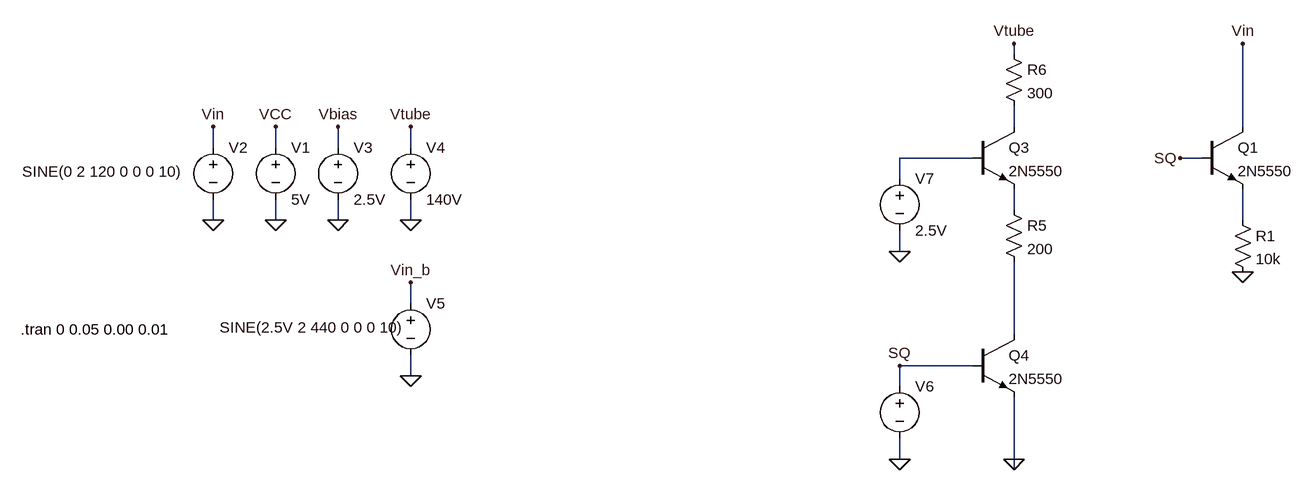
[diagram p0: schematic TubeDriver.asc]
TubeDriver.asc, the LTspice schematic file:
Version 4
SHEET 1 1540 860
WIRE 1072 -16 1072 -32
WIRE 1072 96 1072 64
WIRE 1424 96 1424 -32
WIRE -160 128 -160 96
WIRE -64 128 -64 96
WIRE 32 128 32 96
WIRE 144 128 144 96
WIRE 1008 144 896 144
WIRE 1360 144 1328 144
WIRE 896 176 896 144
WIRE 1072 224 1072 192
WIRE -160 240 -160 208
WIRE -64 240 -64 208
WIRE 32 240 32 208
WIRE 144 240 144 208
WIRE 1424 240 1424 192
WIRE 896 288 896 256
WIRE 144 368 144 336
WIRE 1072 416 1072 304
WIRE 1008 464 896 464
WIRE 144 480 144 448
WIRE 896 496 896 464
WIRE 896 608 896 576
WIRE 1072 608 1072 512
WIRE 1072 624 1072 608
FLAG -64 240 0
FLAG -160 240 0
FLAG -160 96 Vin
FLAG -64 96 VCC
FLAG 32 240 0
FLAG 32 96 Vbias
FLAG 144 240 0
FLAG 144 96 Vtube
FLAG 144 480 0
FLAG 144 336 Vin_b
FLAG 1072 -32 Vtube
FLAG 896 608 0
FLAG 1072 608 0
FLAG 896 288 0
FLAG 896 464 SQ
FLAG 1424 -32 Vin
FLAG 1328 144 SQ
FLAG 1424 320 0
SYMBOL voltage -64 112 R0
WINDOW 123 0 0 Left 0
WINDOW 39 0 0 Left 0
SYMATTR InstName V1
SYMATTR Value 5V
SYMBOL voltage -160 112 R0
WINDOW 3 -294 53 Left 2
WINDOW 123 0 0 Left 0
WINDOW 39 0 0 Left 0
SYMATTR Value SINE(0 2 120 0 0 0 10)
SYMATTR InstName V2
SYMBOL voltage 32 112 R0
WINDOW 123 0 0 Left 0
WINDOW 39 0 0 Left 0
SYMATTR InstName V3
SYMATTR Value 2.5V
SYMBOL voltage 144 112 R0
WINDOW 123 0 0 Left 0
WINDOW 39 0 0 Left 0
SYMATTR InstName V4
SYMATTR Value 140V
SYMBOL voltage 144 352 R0
WINDOW 3 -294 53 Left 2
WINDOW 123 0 0 Left 0
WINDOW 39 0 0 Left 0
SYMATTR Value SINE(2.5V 2 440 0 0 0 10)
SYMATTR InstName V5
SYMBOL npn 1008 96 R0
SYMATTR InstName Q3
SYMATTR Value 2N5550
SYMBOL res 1056 208 R0
SYMATTR InstName R5
SYMATTR Value 200
SYMBOL res 1056 -32 R0
SYMATTR InstName R6
SYMATTR Value 300
SYMBOL voltage 896 480 R0
WINDOW 3 -294 53 Invisible 2
WINDOW 123 0 0 Left 0
WINDOW 39 0 0 Left 0
SYMATTR Value PULSE(0 5 0 0 0 0.0083 0.0166 10)
SYMATTR InstName V6
SYMBOL npn 1008 416 R0
SYMATTR InstName Q4
SYMATTR Value 2N5550
SYMBOL voltage 896 160 R0
WINDOW 123 0 0 Left 0
WINDOW 39 0 0 Left 0
SYMATTR InstName V7
SYMATTR Value 2.5V
SYMBOL npn 1360 96 R0
SYMATTR InstName Q1
SYMATTR Value 2N5550
SYMBOL res 1408 224 R0
SYMATTR InstName R1
SYMATTR Value 10k
TEXT -456 408 Left 2 !.tran 0 0.05 0.00 0.01

The netlist it stands for:
* TubeDriver.asc
V1 VCC 0 5V
V2 Vin 0 SINE(0 2 120 0 0 0 10)
V3 Vbias 0 2.5V
V4 Vtube 0 140V
V5 Vin_b 0 SINE(2.5V 2 440 0 0 0 10)
Q3 N001 N002 N003 0 2N5550
R5 N003 N005 200
R6 Vtube N001 300
V6 SQ 0 PULSE(0 5 0 0 0 0.0083 0.0166 10)
Q4 N005 SQ 0 0 2N5550
V7 N002 0 2.5V
Q1 Vin SQ N004 0 2N5550
R1 N004 0 10k
.model NPN NPN
.model PNP PNP
.lib standard.bjt
.tran 0 0.05 0.00 0.01
.backanno
.end